# EAGLE design video_board_yis805 (EAGLE 7.5.0)
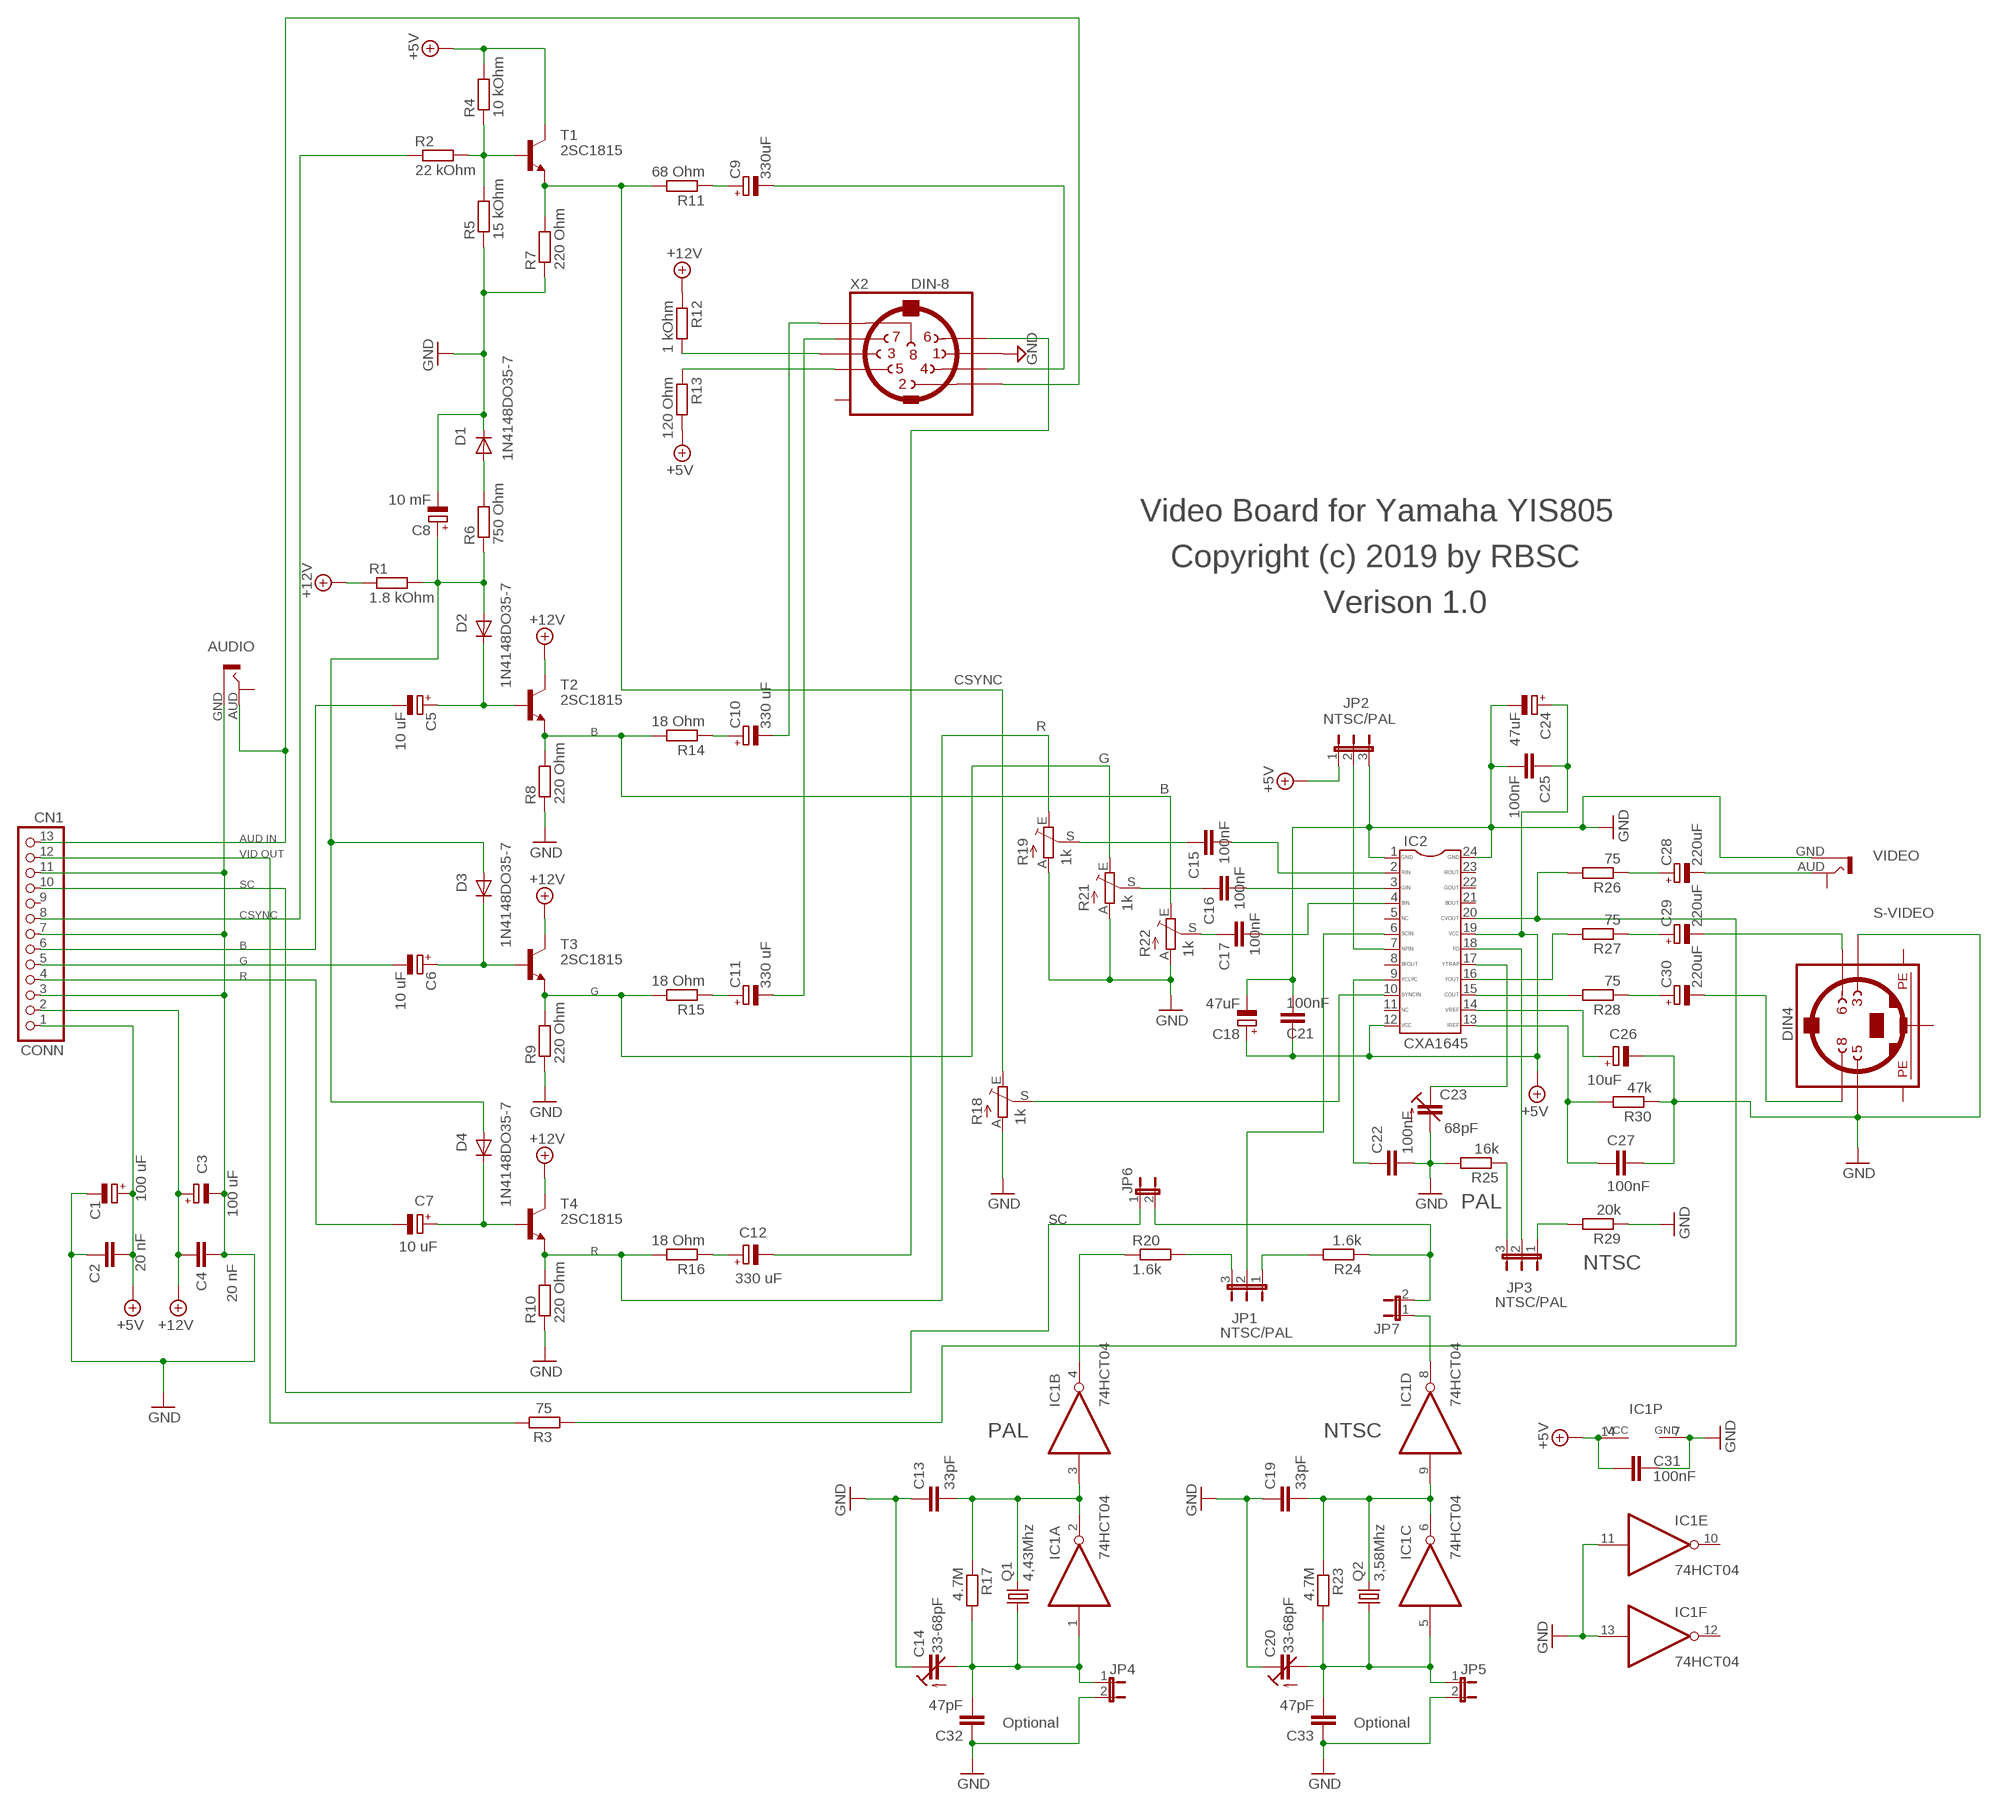
[diagram p0: schematic, sheet 1]

## Parts
AUDIO  RCA  [RCA]
C1  100 uF  CPOL-EUSMCD  [SMC_D]
C2  20 nF  C-EUC0805  [C0805]
C3  100 uF  CPOL-EUSMCD  [SMC_D]
C4  20 nF  C-EUC0805  [C0805]
C5  10 uF  CPOL-EUSMCB  [SMC_B]
C6  10 uF  CPOL-EUSMCB  [SMC_B]
C7  10 uF  CPOL-EUSMCB  [SMC_B]
C8  10 mF  CPOL-EUSMCB  [SMC_B]
C9  330uF  CPOL-EUSMCD  [SMC_D]
C10  330 uF  CPOL-EUSMCD  [SMC_D]
C11  330 uF  CPOL-EUSMCD  [SMC_D]
C12  330 uF  CPOL-EUSMCD  [SMC_D]
C13  33pF  C-EUC0805  [C0805]
C14  33-68pF  C-TRIMMTZ03  [CTRIMTZ03]
C15  100nF  C-EUC0805  [C0805]
C16  100nF  C-EUC0805  [C0805]
C17  100nF  C-EUC0805  [C0805]
C18  47uF  CPOL-EUSMCB  [SMC_B]
C19  33pF  C-EUC0805  [C0805]
C20  33-68pF  C-TRIMMTZ03  [CTRIMTZ03]
C21  100nF  C-EUC0805  [C0805]
C22  100nF  C-EUC0805  [C0805]
C23  68pF  C-TRIMMTZ03  [CTRIMTZ03]
C24  47uF  CPOL-EUSMCB  [SMC_B]
C25  100nF  C-EUC0805  [C0805]
C26  10uF  CPOL-EUSMCB  [SMC_B]
C27  100nF  C-EUC0805  [C0805]
C28  220uF  CPOL-EUSMCD  [SMC_D]
C29  220uF  CPOL-EUSMCD  [SMC_D]
C30  220uF  CPOL-EUSMCD  [SMC_D]
C31  100nF  C-EUC0805  [C0805]
C32  47pF  C-EUC0805  [C0805]
C33  47pF  C-EUC0805  [C0805]
CONN  CN1  PINHD-1X13  [1X13]
D1  1N4148DO35-7  DIODE-MINIMELF  [MINIMELF]
D2  1N4148DO35-7  DIODE-MINIMELF  [MINIMELF]
D3  1N4148DO35-7  DIODE-MINIMELF  [MINIMELF]
D4  1N4148DO35-7  DIODE-MINIMELF  [MINIMELF]
IC1  74HCT04  74HCT04D  [SO14]
IC2  CXA1645  [SOP24]
JP1  NTSC/PAL  JP2E  [JP2]
JP2  NTSC/PAL  JP2E  [JP2]
JP3  NTSC/PAL  JP2E  [JP2]
JP4  JP1E  [JP1]
JP5  JP1E  [JP1]
JP6  JP1E  [JP1]
JP7  JP1E  [JP1]
Q1  4,43Mhz  CRYSTALHC49S  [HC49/S]
Q2  3,58Mhz  CRYSTALHC49S  [HC49/S]
R1  1.8 kOhm  R-EU_R0805  [R0805]
R2  22 kOhm  R-EU_R0805  [R0805]
R3  75  R-EU_R0805  [R0805]
R4  10 kOhm  R-EU_R0805  [R0805]
R5  15 kOhm  R-EU_R0805  [R0805]
R6  750 Ohm  R-EU_R0805  [R0805]
R7  220 Ohm  R-EU_R0805  [R0805]
R8  220 Ohm  R-EU_R0805  [R0805]
R9  220 Ohm  R-EU_R0805  [R0805]
R10  220 Ohm  R-EU_R0805  [R0805]
R11  68 Ohm  R-EU_R0805  [R0805]
R12  1 kOhm  R-EU_R0805  [R0805]
R13  120 Ohm  R-EU_R0805  [R0805]
R14  18 Ohm  R-EU_R0805  [R0805]
R15  18 Ohm  R-EU_R0805  [R0805]
R16  18 Ohm  R-EU_R0805  [R0805]
R17  4.7M  R-EU_R0805  [R0805]
R18  1k  TRIM_EU-CA6V  [CA6V]
R19  1k  TRIM_EU-CA6V  [CA6V]
R20  1.6k  R-EU_R0805  [R0805]
R21  1k  TRIM_EU-CA6V  [CA6V]
R22  1k  TRIM_EU-CA6V  [CA6V]
R23  4.7M  R-EU_R0805  [R0805]
R24  1.6k  R-EU_R0805  [R0805]
R25  16k  R-EU_R0805  [R0805]
R26  75  R-EU_R0805  [R0805]
R27  75  R-EU_R0805  [R0805]
R28  75  R-EU_R0805  [R0805]
R29  20k  R-EU_R0805  [R0805]
R30  47k  R-EU_R0805  [R0805]
S-VIDEO  DIN4  MINI_DIN_4  [M_DIN4]
T1  2SC1815  [TO92-ECB]
T2  2SC1815  [TO92-ECB]
T3  2SC1815  [TO92-ECB]
T4  2SC1815  [TO92-ECB]
VIDEO  RCA  [RCA]
X2  DIN-8  [DIN8]

## Nets
+5V: C1.+ C2.1 C18.+ C21.1 C24.+ C25.1 C31.2 CONN.1 IC1.14(P:VCC) IC2.12 IC2.19 JP2.1 R4.2 R13.2 T1.C
+12V: C3.+ C4.1 CONN.2 R1.1 R12.1 T2.C T3.C T4.C
GND: AUDIO.GND(GND1) C1.- C2.2 C3.- C4.2 C8.- C13.1 C14.1(E) C18.- C19.1 C20.1(E) C21.2 C22.2 C23.2(A) C24.- C25.2 C26.- C27.2 C31.1 C32.1 C33.1 CONN.3 CONN.7 CONN.11 D1.C IC1.7(P:GND) IC1.11(E:I) IC1.13(F:I) IC2.1 IC2.24 JP2.3 JP4.2 JP5.2 R5.1 R7.1 R8.1 R9.1 R10.1 R18.A R19.A R21.A R22.A R25.2 R29.1 R30.1 S-VIDEO.3 S-VIDEO.5 VIDEO.GND(GND1) X2.1
N$1: R10.2 R16.2 R19.E T4.E
N$2: C20.2(A) C33.2 IC1.5(C:I) JP5.1 Q2.1 R23.2
N$3: JP6.2 JP7.2 R24.1
N$4: CONN.8 R2.1
N$5: R8.2 R14.2 R22.E T2.E
N$6: C15.1 R19.S
N$7: C16.1 R21.S
N$8: IC1.4(B:O) R20.1
N$9: JP1.1 R24.2
N$10: C19.2 IC1.6(C:O) IC1.9(D:I) Q2.2 R23.1
N$11: JP1.3 R20.2
N$12: C8.+ D2.A D3.A D4.A R1.2 R6.1
N$13: JP3.3 R25.1
N$14: IC2.7 JP2.2
N$15: JP3.1 R29.2
N$16: IC2.16 R27.2
N$18: IC1.8(D:O) JP7.1
N$19: CONN.12 R3.2
N$24: C23.1(E) IC2.17
N$26: C12.- X2.6
N$27: C11.- X2.7
N$29: C6.+ D3.C T3.B
N$30: C10.- X2.8
N$31: D1.A R6.2
N$32: C6.- CONN.5
N$33: C5.- CONN.6
N$34: AUDIO.AUD CONN.13 X2.2
N$35: C12.+ R16.1
N$36: R12.2 X2.3
N$37: R9.2 R15.2 R21.E T3.E
N$38: R13.1 X2.5
N$39: C7.+ D4.C T4.B
N$42: C7.- CONN.4
N$43: C5.+ D2.C T2.B
N$47: R2.2 R4.1 R5.2 T1.B
N$50: R7.2 R11.2 R18.E T1.E
N$51: C11.+ R15.1
N$52: C10.+ R14.1
N$53: C9.+ R11.1
N$54: C9.- X2.4
N$55: C17.1 R22.S
N$56: C16.2 IC2.3
N$57: C15.2 IC2.2
N$58: C17.2 IC2.4
N$59: C14.2(A) C32.2 IC1.1(A:I) JP4.1 Q1.1 R17.2
N$60: C13.2 IC1.2(A:O) IC1.3(B:I) Q1.2 R17.1
N$61: IC2.10 R18.S
N$63: IC2.6 JP1.2
N$64: IC2.20 R3.1 R26.2
N$65: C22.1 IC2.9
N$66: IC2.18 JP3.2
N$68: IC2.15 R28.2
N$69: C28.+ R26.1
N$70: C29.+ R27.1
N$71: C30.+ R28.1
N$72: C26.+ IC2.14
N$73: C27.1 IC2.13 R30.2
N$75: C28.- VIDEO.AUD
N$78: C29.- S-VIDEO.6
N$79: C30.- S-VIDEO.8
SC: CONN.10 JP6.1
Unconnected: AUDIO.AUD1 CONN.9 IC1.10(E:O) IC1.12(F:O) IC2.5 IC2.8 IC2.11 IC2.21 IC2.22 IC2.23 VIDEO.AUD1 X2.GND

## Notes on the sheet
- Video Board for Yamaha YIS805
- Copyright (c) 2019 by RBSC
- Verison 1.0
- CSYNC
- R
- B
- G
- B
- AUD IN
- VID OUT
- CSYNC
- B
- G
- R
- G
- PAL
- R
- NTSC
- PAL | NTSC
- Optional | Optional

## Power pins joined to a net without a drawn wire
PE1: S-VIDEO.SH1(PE1)
PE2: S-VIDEO.SH2(PE2)
PE3: S-VIDEO.SH3(PE3)

## Library data of the parts
AUDIO VIDEO = rca:RCA: RCA connector Cinch
C1 C3 C5-C12 = rcl:CPOL-EU: POLARIZED CAPACITOR, European symbol
C2 C4 = rcl:C-EU: CAPACITOR, European symbol
C13 C15-C17 C19 C21 C22 C25 C27 C31-C33 = rcl:C-EU: CAPACITOR, European symbol; OC_FARNELL: unknown
C14 C20 = rcl:C-TRIMM: Trimm capacitor; OC_FARNELL: unknown
C18 C24 C26 C28-C30 = rcl:CPOL-EU: POLARIZED CAPACITOR, European symbol; OC_FARNELL: unknown
C23 = rcl:C-TRIMM: Trimm capacitor
CONN = pinhead:PINHD-1X13: PIN HEADER
D1-D4 = diode:DIODE-: DIODE
IC1 = 74xx-eu:74*04: Hex INVERTER
IC2 = CXA1645M:CXA1645; OC_FARNELL: unknown
JP1-JP3 = jumper:JP2E: JUMPER
JP4-JP7 = jumper:JP1E: JUMPER
Q1 Q2 = crystal:CRYSTAL: CRYSTAL; MF: MULTICOMP; MPN: HC49SM-3.6864-30-50-60-16-ATF; OC_FARNELL: 1667008; OC_NEWARK: unknown
R1 R2 R4-R16 = resistor:R-EU_: RESISTOR, European symbol
R3 R17 R20 R23-R30 = rcl:R-EU_: RESISTOR, European symbol; OC_FARNELL: unknown
R18 R19 R21 R22 = pot:TRIM_EU-: POTENTIOMETER; OC_FARNELL: unknown
S-VIDEO = mini_din:MINI_DIN_4
T1-T4 = transistor:2SC1815: NPN EPITAXIAL TRANSISTOR Source: TOSHIBA .. 2SC1815 1.pdf
X2 = din8:DIN-8: Female CONNECTOR 8 pins with shield, horizontal (DIN 41524)

## Board
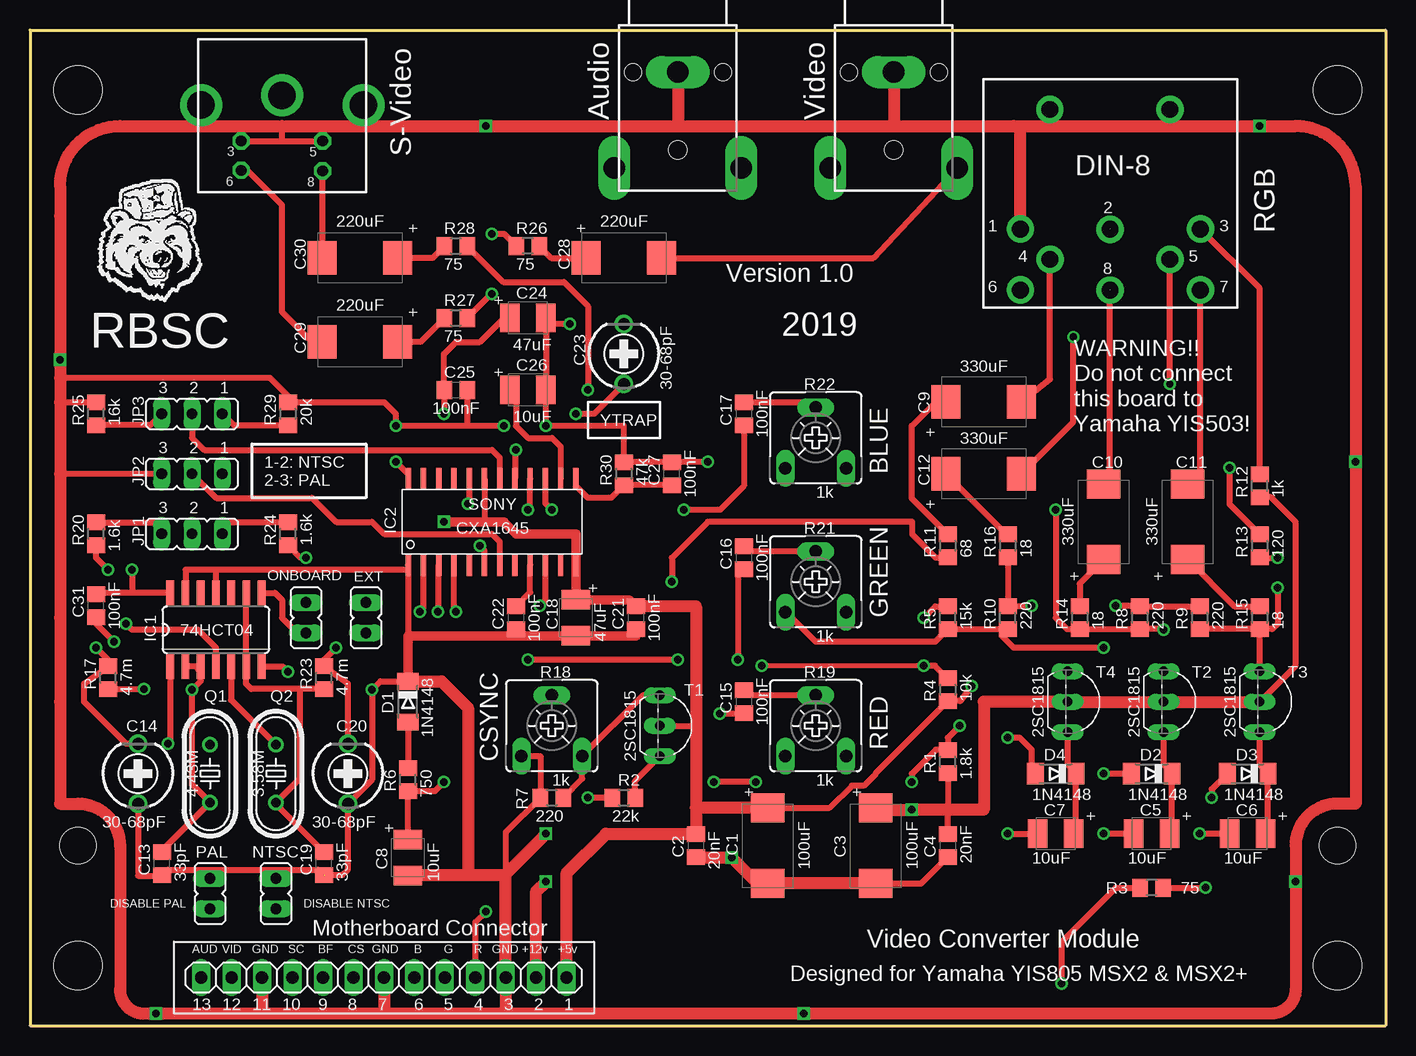
[diagram p1: board, top side]
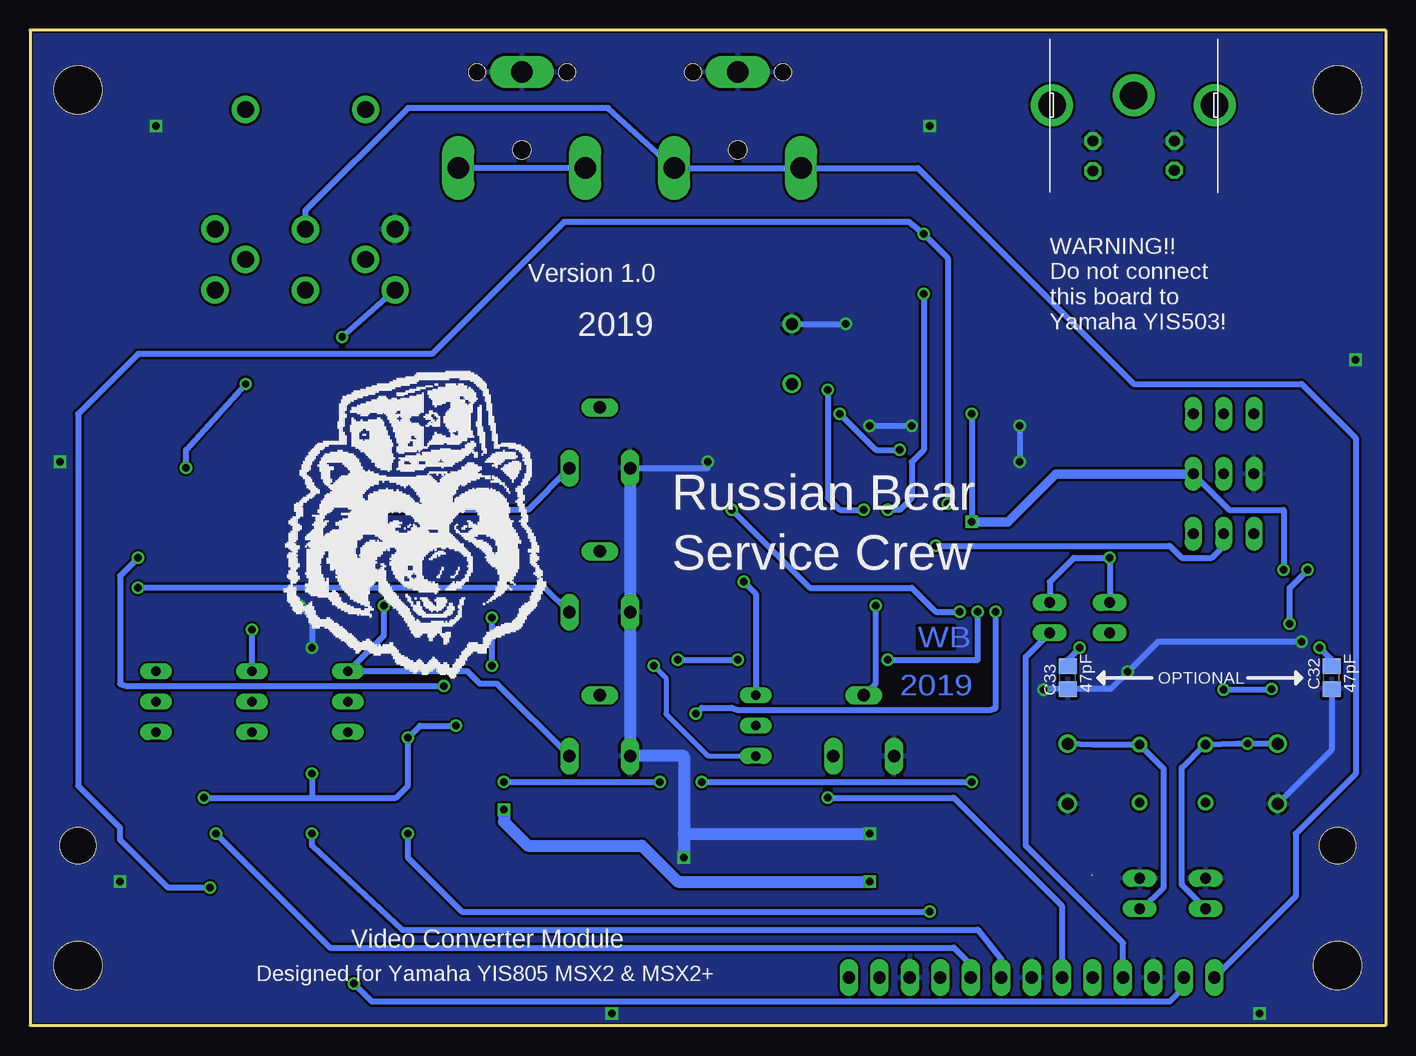
[diagram p2: board, bottom side, seen from below]

Size 113 x 83 mm. Coordinates in mm from the lower left corner, seen from the top.
Outline: 0,83 0,0 113,0 113,83 0,83
Copper layers (1*16): Top 0.035mm / dielectric 1.5mm / Bottom 0.035mm
Design rules "default *": minimum track width 10mil, minimum drill 24mil, track to track 8mil, track to pad 8mil, pad to pad 8mil, via to via 8mil, smd to smd 8mil, copper to edge 4mil, drill to drill 8mil, minimum pad ring 10mil, minimum via ring 8mil, stop-mask expansion 4mil, vias tented up to drill 24mil, thermal gap 10mil
Holes 4 mm at 4,78 109,78 4,5 109,5
Holes 3 mm at 4,15 109,15

### Footprints (pad centres in the part's own frame; a part is rotated, then mirrored left to right if it is on the bottom)
RCA = drill 1.778 pad 2.2 long: AUD 5.3,-12; AUD1 -5.283,-12; GND 0,-4 | hole 1.4: -3.75,-4; 3.75,-4 | hole 1.5: 0,-10.5
SMC_D = smd 2.4 x 2.8: + -3.15,0; - 3.15,0
C0805 = smd 1.3 x 1.5: 1 -0.95,0; 2 0.95,0
SMC_B = smd 1.6 x 2.4: + -1.5,0; - 1.5,0
CTRIMTZ03 = drill 1: 1 0,2.5; 2 0,-2.5
1X13 = drill 1.016 long: 1 -15.24,0; 2 -12.7,0; 3 -10.16,0; 4 -7.62,0; 5 -5.08,0; 6 -2.54,0; 7 0,0; 8 2.54,0; 9 5.08,0; 10 7.62,0; 11 10.16,0; 12 12.7,0; 13 15.24,0
MINIMELF = smd 1.4 x 1.8: A 1.7,0; C -1.7,0
SO14 = smd 0.66 x 2.032: 1 -3.81,-3.073; 2 -2.54,-3.073; 3 -1.27,-3.073; 4 0,-3.073; 5 1.27,-3.073; 6 2.54,-3.073; 7 3.81,-3.073; 8 3.81,3.073; 9 2.54,3.073; 10 1.27,3.073; 11 0,3.073; 12 -1.27,3.073; 13 -2.54,3.073; 14 -3.81,3.073
SOP24 = smd 0.45 x 1.8: 1 -6.97,-3.6; 2 -5.7,-3.6; 3 -4.43,-3.6; 4 -3.16,-3.6; 5 -1.89,-3.6; 6 -0.62,-3.6; 7 0.65,-3.6; 8 1.92,-3.6; 9 3.19,-3.6; 10 4.46,-3.6; 11 5.73,-3.6; 12 7,-3.6; 13 7,3.6; 14 5.73,3.6; 15 4.46,3.6; 16 3.19,3.6; 17 1.92,3.6; 18 0.65,3.6; 19 -0.62,3.6; 20 -1.89,3.6; 21 -3.16,3.6; 22 -4.43,3.6; 23 -5.7,3.6; 24 -6.97,3.6
JP2 = drill 0.914 long: 1 -2.54,0; 2 0,0; 3 2.54,0
JP1 = drill 0.914 long: 1 0,-1.27; 2 0,1.27
HC49/S = drill 0.813: 1 -2.413,0; 2 2.413,0
R0805 = smd 1.3 x 1.5: 1 -0.95,0; 2 0.95,0
CA6V = drill 1.016 long: A -2.54,-2.54; E 2.54,-2.54; S 0,2.54
M_DIN4 = drill 0.9 pad 1.422 octagon: 3 -3.4,-3.75; 5 3.4,-3.75; 6 -3.4,-6.2; 8 3.4,-6.25 | drill 2.3 pad 3.5: SH1 6.8,-0.75; SH2 0,0.05; SH3 -6.75,-0.75
TO92-ECB = drill 0.813 long: B 2.54,0; C 0,0; E -2.54,0
DIN8 = drill 1.4 pad 2.286: 1 7.94,3.6; 2 0.46,3.61; 3 -7.07,3.6; 4 5.47,6.13; 5 -4.53,6.12; 6 7.94,8.68; 7 -7.07,8.68; 8 0.46,8.69; GND -4.53,-6.382; GNDEX 5.48,-6.382

### Placement (x,y rotation side)
AUDIO  54,83.5 0 top
C1  61.5,15 270 top
C2  55.5,15 270 top
C3  70.5,15 270 top
C4  76.5,15 270 top
C5  93.5,16 180 top
C6  101.5,16 180 top
C7  85.5,16 180 top
C8  31.5,14 270 top
C9  79.5,52 0 top
C10  89.5,42 90 top
C11  96.5,42 90 top
C12  79.5,46 0 top
C13  11,13.5 90 top
C14  9,21 180 top
C15  59.5,27 270 top
C16  59.5,39 270 top
C17  59.5,51 270 top
C18  45.5,34 270 top
C19  24.5,13.5 90 top
C20  26.5,21 180 top
C21  50.5,34 270 top
C22  40.5,34 270 top
C23  49.5,56 180 top
C24  41.5,59 0 top
C25  35.5,53 0 top
C26  41.5,53 0 top
C27  53.5,46 90 top
C28  49.5,64 0 top
C29  27.5,57 180 top
C30  27.5,64 180 top
C31  5.5,35 90 top
C32  4.5,29 90 bottom
C33  26.5,29 90 bottom
CONN  29.5,4 180 top
D1  31.5,27 270 top
D2  93.5,21 180 top
D3  101.5,21 180 top
D4  85.5,21 180 top
IC1  15.5,33 0 top
IC2  38.5,42 0 top
JP1  13.5,41 180 top
JP2  13.5,46 180 top
JP3  13.5,51 180 top
JP4  15,11 0 top
JP5  20.5,11 0 top
JP6  28,34 0 top
JP7  23,34 0 top
Q1  15,21 270 top
Q2  20.5,21 270 top
R1  76.5,22 90 top
R2  49.5,19 0 top
R3  93.5,11.5 180 top
R4  76.5,28 270 top
R5  76.5,34 90 top
R6  31.5,20.5 90 top
R7  43.5,19 0 top
R8  92.5,34 270 top
R9  97.5,34 270 top
R10  81.5,34 90 top
R11  76.5,40 270 top
R12  102.5,45 90 top
R13  102.5,40 270 top
R14  87.5,34 270 top
R15  102.5,34 270 top
R16  81.5,40 270 top
R17  6.5,29 90 top
R18  43.5,25 0 top
R19  65.5,25 0 top
R20  5.5,41 90 top
R21  65.5,37 0 top
R22  65.5,49 0 top
R23  24.5,29 90 top
R24  21.5,41 90 top
R25  5.5,51 90 top
R26  41.5,65 180 top
R27  35.5,59 0 top
R28  35.5,65 0 top
R29  21.5,51 270 top
R30  49.5,46 270 top
S-VIDEO  21,77.5 0 top
T1  52.5,25 270 top
T2  94.5,27 270 top
T3  102.5,27 270 top
T4  86.5,27 270 top
VIDEO  72,83.5 0 top
X2  90.5,70 180 top

### Tracks (layer width: path | path; a pad name or v marks a point on that pad's centre or on a via)
+5V  (via drill 0.6)
  Top 0.5: T1.C 55.5,25 | IC1.14 8.5,36.07 | v8.5,38 8.5,36.07 | C24.+ 39.5,59 37.5,57 35.5,57 34.5,56 34.5,53.05 C25.1 34.5,52.95 v34.5,51 | R13.2 102.55,39 v104,39 | v78.5,28.3 77.55,27.05 R4.2 70.5,21.05 70.5,21 69.5,20 68.5,20 66.65,18.15 C1.+ | 8.5,36.07 5.62,36.07 C31.2 | IC2.19 37.88,42.12 38,42
  Top 0.8: v34.5,42 38,42 39.5,42 40.5,41 45.5,41 IC2.12 C18.+ 49.95,35.5 C21.1
  Top 1: C1.+ 55.5,18.15 | 55.5,18.15 C2.1 55.45,16 48,16 44.74,12.74 CONN.1 | 55.5,18.15 55.5,25 55.5,34.95 C21.1
  Bottom 0.5: JP2.1 13.04,43 8.5,43 v8.5,38 | v34.5,51 v34.5,42 | v104,39 105.5,37.5 105.5,28.5 105,28.3 v78.5,28.3
  Bottom 0.8: v34.5,42 31.5,42 27.5,46 JP2.1
+12V  (via drill 0.6)
  Top 0.406: C3.+ 71,18.15 71,18
  Top 0.5: C4.1 76.5,18 R1.1 | T3.C 105.5,30 105.5,42 103.45,44.05 R12.1 102.55,44
  Top 1: 70.5,18 71,18 v73.5,18 76.5,18 79.5,18 79.5,27 T4.C T2.C T3.C | CONN.2 42.2,11.2 v43,12
  Bottom 1: v73.5,18 73.5,17 71.5,15 62,15 59,12 v43,12
GND  (via drill 0.6)  (1 unrouted)
  Top 0.406: v56.5,47 53.5,47 C27.2 | 49.5,47 R30.1
  Top 0.5: R25.2 2.5,51.95 | v56.5,47 49.5,47 49.5,50 v43,50 C26.- C24.- 43.5,58.5 v45,58.5 | 50.5,32.5 C21.2 | R18.A 42.55,22.46 R7.1 39.66,16.11 39.66,12.66 39.5,12.5 | IC2.1 31.5,38.4 31.5,38 | 31.5,38 31.5,32.5 | 31.5,38 15.5,38 | IC1.11 15.5,38 | 15.5,38 12.96,38 IC1.13 | JP2.3 2.5,46 | 2.5,34.05 2.5,34 2.55,34.05 | 81,33.05 R5.1 75.45,32 65.5,32 63.04,34.46 R21.A | 81,33.05 R10.1 | R9.1 R8.1 92.45,35 v90.5,35 | v89.5,31.5 82,31.5 81,32.5 81,33.05 | R29.1 29.55,51.95 30.5,51 v30.5,50 36.5,50 | v30.5,47 31.53,45.97 IC2.24 | 40.5,32.5 C22.2 | IC1.7 21.07,29.93 v21.5,29.5 | 21.5,52.5 20,54 2.5,54 | C3.- 74.3,11.85 C4.2 | C8.- 31.05,12.5 31,12.55 | C14.1 9,12.5 10.95,12.5 C13.1 | C31.1 5.5,33.5 v7,32 | D1.C 29.2,28.7 v28.5,28 28.5,20.5 C20.1 26.5,13 26.05,12.55 C19.1 | C25.2 36.45,50.05 36.5,50 | v39.5,50 36.5,50 | 21,73.75 S-VIDEO.5 | S-VIDEO.3 21,73.75 | 21,73.75 21,75 | 11,12.5 11.5,13 24,13 24.5,12.5
  Top 0.8: 50.5,32.5 C18.- 40.5,32.5 31.5,32.5 D1.C
  Top 1: 2.5,27 2.5,34 2.5,46 2.5,51.95 2.5,54 v2.5,55.5 | v2.5,55.5 2.5,70 arc-90 7.5,75 21,75 v38,75 54,75 | C25.2 36.5,53 | R7.1 42.5,19 | 54,75 72,75 | 72,75 82,75 | 82,75 v102.5,75 105.5,75 arc-90 110.5,70 v110.5,47 110.5,18.5 109,18.5 arc90 105.5,15 v105.5,12 105.5,3 arc-90 103.5,1 v64.5,1 39.5,1 | AUDIO.GND 54,75 | VIDEO.GND 72,75 | X2.1 82.56,74.94 82,75 | 39.5,1 29.5,1 | 29.5,1 19.5,1 | 19.5,1 v10.5,1 9.5,1 arc-90 7.5,3 7.5,15 arc90 4,18.5 2.5,18.5 v2.5,55.5 | 2.5,67.5 v2.5,55.5 | CONN.11 19.34,1.16 19.5,1 | CONN.7 29.5,1 | 39.5,1 39.66,1.16 CONN.3 39.66,12.5 39.61,12.55 36.5,12.55 | 31,12.55 36.5,12.55 | C3.- C1.- 60.65,11.85 v58.5,14 55.55,14 C2.2 | 39.5,12.5 v43,16 | D1.C 34.3,28.7 36.5,26.5 36.5,12.55
  Bottom 0.5: R22.A 56.5,46.46 v56.5,47 | v90.5,35 89.5,34 v89.5,31.5 | v28.5,28 28.45,28.05 C33.1 22.95,28.05 v21.5,29.5 19,32 v7,32 | C32.1 4.5,23 C14.1 | C23.2 v45,58.5 | v30.5,50 v30.5,47 | v39.5,50 v43,50
  Bottom 1: 58.5,16 58.5,22.46 R19.A R21.A R22.A | 58.5,16 v43,16 | 58.5,16 v58.5,14
  pour Bottom: 0,83 113,83 113,0 0,0
N$1  (via drill 0.6)
  Top 0.5: R16.2 R10.2 83.45,34.95 v83.5,35
  Bottom 0.5: v83.5,35 83.5,32.54 T4.E 76.54,29.54 75.5,28.5 74.08,28.5 R19.E
N$2  (via drill 0.6)
  Top 0.5: 24.55,30 R23.2 | C20.2 26.5,28.5 R23.2 | v25.5,31.5 24.5,30.5 R23.2 | IC1.5 16.77,27.14 Q2.1
  Bottom 0.5: C20.2 24.41,23.41 Q2.1 18.5,21.41 18.5,11.5 20.27,9.73 JP5.1 | C33.2 26.5,30.5 v25.5,31.5
N$3  (via drill 0.6)
  Top 0.5: R24.1 22.55,39 v23,39
  Bottom 0.5: JP6.2 28,37 26,39 v23,39 JP7.2
N$4  (via drill 0.6)
  Top 0.5: R2.1 v46.5,19
  Bottom 0.5: v46.5,19 36,19 27,10 27,4.04 CONN.8
N$5  (via drill 0.6)
  Top 0.5: v94.5,33 94.45,33.05 R8.2 R14.2 86.45,33.05 85.5,34 v85.5,43
  Bottom 0.5: T2.E v94.5,33 | R22.E 71.5,43 v85.5,43
N$6
  Top 0.5: R19.S 59.5,27.54 C15.1
N$7
  Top 0.5: R21.S 59.5,39.54 C16.1
N$8  (via drill 0.6)
  Top 0.5: IC1.4 15.5,31.5 14,33 8.5,33 v8,33.5 | v6.5,38 5.5,39 R20.1
  Bottom 0.5: v8,33.5 8,36.5 v6.5,38
N$9
  Top 0.5: R24.2 16.04,41.95 JP1.1
N$10
  Top 0.5: IC1.9 IC1.6 18,29.89 18,28.5 18.45,28.05 22.5,28.05 | R23.1 22.5,28.05 | 22.5,28.05 22.5,20.59 Q2.2 20.5,18.45 C19.2
N$11
  Top 0.5: R20.2 10.96,41.95 JP1.3
N$12  (via drill 0.6)
  Top 0.5: C8.+ R6.1 33.75,19.55 v34.5,20.3 | v77.5,25 76.5,24 R1.2 76.45,23 75.5,23 73.5,21 v73.5,20.3 | D3.A 98.5,19.7 v98.5,19 | D2.A v89.5,21 | D4.A 83.5,21.3 83.5,23 82.5,24 v81.5,24 | v60.5,20.3 v57,20.3
  Bottom 0.5: v77.5,25 80.5,25 v81.5,24 81.5,20 82.5,19 89.5,19 | v98.5,19 89.5,19 | v89.5,21 89.5,19 | v73.5,20.3 v60.5,20.3 | v57,20.3 v34.5,20.3
N$13
  Top 0.5: JP3.3 10.01,50.05 R25.1
N$14
  Top 0.5: JP2.2 15.5,44 23.5,44 25.5,42 28.5,42 29.5,41 38.5,41 39.15,40.35 IC2.7
N$15
  Top 0.5: JP3.1 16.99,50.05 R29.2
N$16  (via drill 0.6)
  Top 0.5: R27.2 38.45,61 v38.5,61 | v41.5,43 41.69,43.19 IC2.16
  Bottom 0.5: v38.5,61 38.5,48 39.5,47 39.5,44 40.5,43 v41.5,43
N$17
  Bottom 0.5: 66.5,71.5 77.5,71.5
N$18
  Top 0.5: IC1.8 20.43,36.07 21,35.5 21,34 22.27,32.73 JP7.1
N$19  (via drill 0.6)
  Top 0.5: v86,3.5 86,7 90.5,11.5 R3.2
  Bottom 0.5: CONN.12 16.8,3.2 18,2 84.5,2 v86,3.5
N$24  (via drill 0.6)
  Top 0.5: C23.1 47,51 v45.5,51 | v40.5,48 40.42,47.92 IC2.17
  Bottom 0.5: v45.5,51 42.5,48 v40.5,48
N$26  (via drill 0.6)
  Top 0.5: C12.- 86.97,50.32 v86.97,57.41
  Bottom 0.5: v86.97,57.41 X2.6
N$27
  Top 0.5: C11.- 97.57,46.22 X2.7
N$29
  Top 0.5: C6.+ 103.2,16.2 D3.C 102.5,21.7 T3.B
N$30
  Top 0.5: C10.- 90.04,45.69 X2.8
N$31
  Top 0.5: D1.A R6.2
N$32  (via drill 0.6)
  Top 0.5: C6.- v97.5,16
  Bottom 0.5: v97.5,16 88,6.5 36,6.5 34.58,5.08 CONN.5
N$33  (via drill 0.6)
  Top 0.5: C5.- v89.5,16
  Bottom 0.5: v89.5,16 89.5,15 82,8 34,8 32.04,5.54 CONN.6
N$34
  Bottom 0.5: X2.2 90.04,67.96 81.5,76.5 64.8,76.5 AUDIO.AUD 39,71.5 21,53.5 7,53.5 2.5,49 2.5,21 7.5,16 7.5,10.76 CONN.13
N$35
  Top 0.5: C12.+ 81.4,40.95 R16.1
N$36
  Top 0.5: R12.2 102.5,61.47 X2.3
N$37  (via drill 0.6)
  Top 0.5: R15.2 R9.2 | T3.E R15.2 | v104,36.5 104,33.5 103.55,33.05 R15.2
  Bottom 0.5: R21.E 70.08,36.5 v104,36.5
N$38  (via drill 0.6)
  Top 0.5: R13.1 100,43.45 v100,46.5 | v95.03,53.47 X2.5
  Bottom 0.5: v100,46.5 100,48 v95.03,53.47
N$39
  Top 0.5: T4.B 86.5,21.7 D4.C 87.2,16.2 C7.+
N$42  (via drill 0.6)
  Top 0.5: v81.5,16 C7.- | v38,9.5 37.12,8.62 CONN.4
  Bottom 0.5: v81.5,16 81.5,14 77,9.5 v38,9.5
N$43
  Top 0.5: T2.B 94.5,21.7 D2.C 95.2,16.2 C5.+
N$47  (via drill 0.6)
  Top 0.406: v74.5,30 v61,30
  Top 0.5: R4.1 75.45,30 v74.5,30 | v74.5,34 75.45,34.95 R5.2 | R2.2 50.45,20.41 T1.B
  Bottom 0.406: v61,30 60,29 60,26 56.5,22.5 52.54,22.5 T1.B
  Bottom 0.5: v74.5,30 v74.5,34
N$50  (via drill 0.6)
  Top 0.5: R7.2 46.04,20.59 R18.E 51.12,27.54 T1.E | v53.5,37 53.5,39 56.5,42 73.55,42 73.55,40.95 75.5,39 76.45,39 R11.2
  Bottom 0.5: v53.5,37 52.5,36 T1.E
N$51
  Top 0.5: C11.+ 100.4,34.95 R15.1
N$52
  Top 0.5: C10.+ 87.5,36.85 R14.1
N$53
  Top 0.5: R11.1 73.5,43.95 73.5,50 75.5,52 C9.+
N$54
  Top 0.5: C9.- 85.03,53.88 X2.4
N$55
  Top 0.5: R22.S 65.09,51.95 C17.1
N$56  (via drill 0.6)
  Top 0.5: C16.2 59,37.55 v59,30.5 | v54,30.5 v41.5,30.5 | v34,34.5 34.07,34.57 IC2.3
  Bottom 0.5: v59,30.5 v54,30.5 | v41.5,30.5 34,30.5 v34,34.5
N$57  (via drill 0.6)
  Top 0.5: C15.2 59.45,26 v57.5,26 | v32.5,34.5 32.8,34.8 IC2.2
  Bottom 0.5: v57.5,26 57,26.5 54.5,26.5 54,26.3 33,26.3 32.5,26.5 v32.5,34.5
N$58  (via drill 0.6)
  Top 0.5: C17.2 59.5,45 57.5,43 v54.5,43 | v35.5,34.5 35.34,34.66 IC2.4
  Bottom 0.5: v54.5,43 48,36.5 39.5,36.5 37.5,34.5 v35.5,34.5
N$59  (via drill 0.6)
  Top 0.5: R17.2 6.5,30 | R17.2 4.5,28.5 4.5,27 8,23.5 C14.2 | IC1.1 11.69,23.69 v11.5,23.5 | v5.5,31.5 6.5,30.5 R17.2
  Bottom 0.5: C14.2 v11.5,23.5 12.41,23.5 Q1.1 15.09,23.41 17,21.5 17,11.73 JP4.1 | C32.2 4.5,30.5 v5.5,31.5
N$60  (via drill 0.6)
  Top 0.5: IC1.3 IC1.2 13,29.89 | R17.1 v9.5,28.05 | 14,29.7 IC1.3 | IC1.3 14.23,28.73 v13.5,28 13.5,20.09 Q1.2 11,14.59 C13.2
  Bottom 0.5: v9.5,28.05 9.55,28 v13.5,28
N$61  (via drill 0.6)
  Top 0.5: v42.5,35 42.96,35.46 IC2.10
  Bottom 0.5: R18.S 42.5,28.54 v42.5,35
N$63  (via drill 0.6)
  Top 0.5: IC2.6 37.88,39.62 v37.5,40
  Bottom 0.5: v37.5,40 18,40 17,39 14.5,39 13.5,40 JP1.2
N$64  (via drill 0.6)
  Top 0.5: R26.2 39.55,66 v38.5,66 | R3.1 v98,11.5 | IC2.20 36.61,43.61 v36.5,43.5
  Bottom 0.5: v36.5,43.5 36.5,64 v38.5,66 39.5,66.8 39.7,67 68.5,67 79.5,56 104,56 109,51 109,20 105.5,16.5 105.5,15.5 101.5,11.5 v98,11.5
N$65
  Top 0.5: C22.1 41.69,36.14 IC2.9
N$66
  Top 0.5: JP3.2 13.5,49 14.5,48 38.5,48 39.15,47.35 IC2.18
N$68  (via drill 0.6)
  Top 0.5: R28.2 39.45,62 44.5,62 46.5,60 v46.5,53 | v43.5,43 42.96,43.54 IC2.15
  Bottom 0.5: v46.5,53 46.5,44 45.5,43 v43.5,43
N$69
  Top 0.5: R26.1 43.45,64 C28.+
N$70
  Top 0.5: R27.1 32.55,57 C29.+
N$71
  Top 0.5: R28.1 33.55,64 C30.+
N$72
  Top 0.5: C26.+ 40.5,52.5 40.5,50 41.5,49 43.5,49 44.23,48.27 IC2.14
N$73
  Top 0.5: C27.1 R30.2 48.45,44 46.5,44 45.5,45 IC2.13
N$75
  Top 0.5: C28.- 70.3,64 VIDEO.AUD
N$78
  Top 0.5: C29.- 23.5,57 21,59.5 21,68.4 18.1,71.3 S-VIDEO.6
N$79
  Top 0.5: C30.- 24.4,64 S-VIDEO.8
SC
  Bottom 0.5: CONN.10 21.88,6.88 30,15 30,30.73 JP6.1

### Text on the board
Bottom: WB | 2019
tNames: S-Video | Audio | Video | RGB | 220uF | 220uF | + | R28 | R26 | + | C30 | 75 | 75 | C28 | Version 1.0 | + | C24 | 220uF | R27 | 2019 | + | 75 | 47uF | RBSC | C29 | + | C26 | C23 | C25 | 330uF | 30-68pF | R22 | 100nF | 10uF | C9 | R25 | 16k | JP3 | R29 | 20k | YTRAP | C17 | + | WARNING!! / Do not connect / this board to / Yamaha YIS503! | 100nF | 330uF | 1-2: NTSC | BLUE | C10 | C11 | JP2 | 2-3: PAL | R30 | 47k | C27 | C12 | 100nF | 1k | + | R12 | 1k | SONY | IC2 | CXA1645 | R21 | R20 | 1.6k | JP1 | R24 | 1.6k | 330uF | 330uF | R11 | 68 | R16 | 18 | R13 | 120 | ONBOARD | C16 | + | + | EXT | 100nF | + | C31 | GREEN | 100nF | C22 | C18 | C21 | R5 | 15k | R10 | 220 | R14 | 18 | R8 | 220 | R9 | 220 | R15 | 18 | IC1 | 74HCT04 | 100nF | 47uF | 100nF | 1k | T4 | T2 | T3 | R18 | R19 | R17 | 4.7m | R23 | 4.7m | T1 | Q1 | Q2 | R4 | 10k | D1 | C15 | 100nF | C14 | C20 | 1N4148 | 2SC1815 | 2SC1815 | 2SC1815 | 4.43M | 3.58M | RED | CSYNC | 2SC1815 | D4 | D2 | D3 | R1 | R6 | 1k | R2 | 1k | 1.8k | 1N4148 | 1N4148 | 1N4148 | 750 | + | + | R7 | 220 | C7 | C5 | C6 | 22k | + | + | + | 30-68pF | 30-68pF | + | C1 | PAL | NTSC | C2 | C3 | C4 | 20nF | 10uF | 10uF | 10uF | C8 | 20nF | 100uF | 100uF | C13 | 33pF | C19 | 33pF | 10uF | R3 | 75 | DISABLE PAL | DISABLE NTSC | Motherboard Connector | Video Converter Module | AUD | VID | GND | SC | BF | CS | GND | B | G | R | GND | +12v | +5v | Designed for Yamaha YIS805 MSX2 & MSX2+ | 13 | 12 | 11 | 10 | 9 | 8 | 7 | 6 | 5 | 4 | 3 | 2 | 1
bNames: Version 1.0 | 2019 | WARNING!! / Do not connect / this board to / Yamaha YIS503! | Russian Bear | Service Crew | 47pF | 47pF | C32 | OPTIONAL | C33 | Video Converter Module | Designed for Yamaha YIS805 MSX2 & MSX2+